# EAGLE design ATmega16 Testboard v2 (EAGLE 4.15)
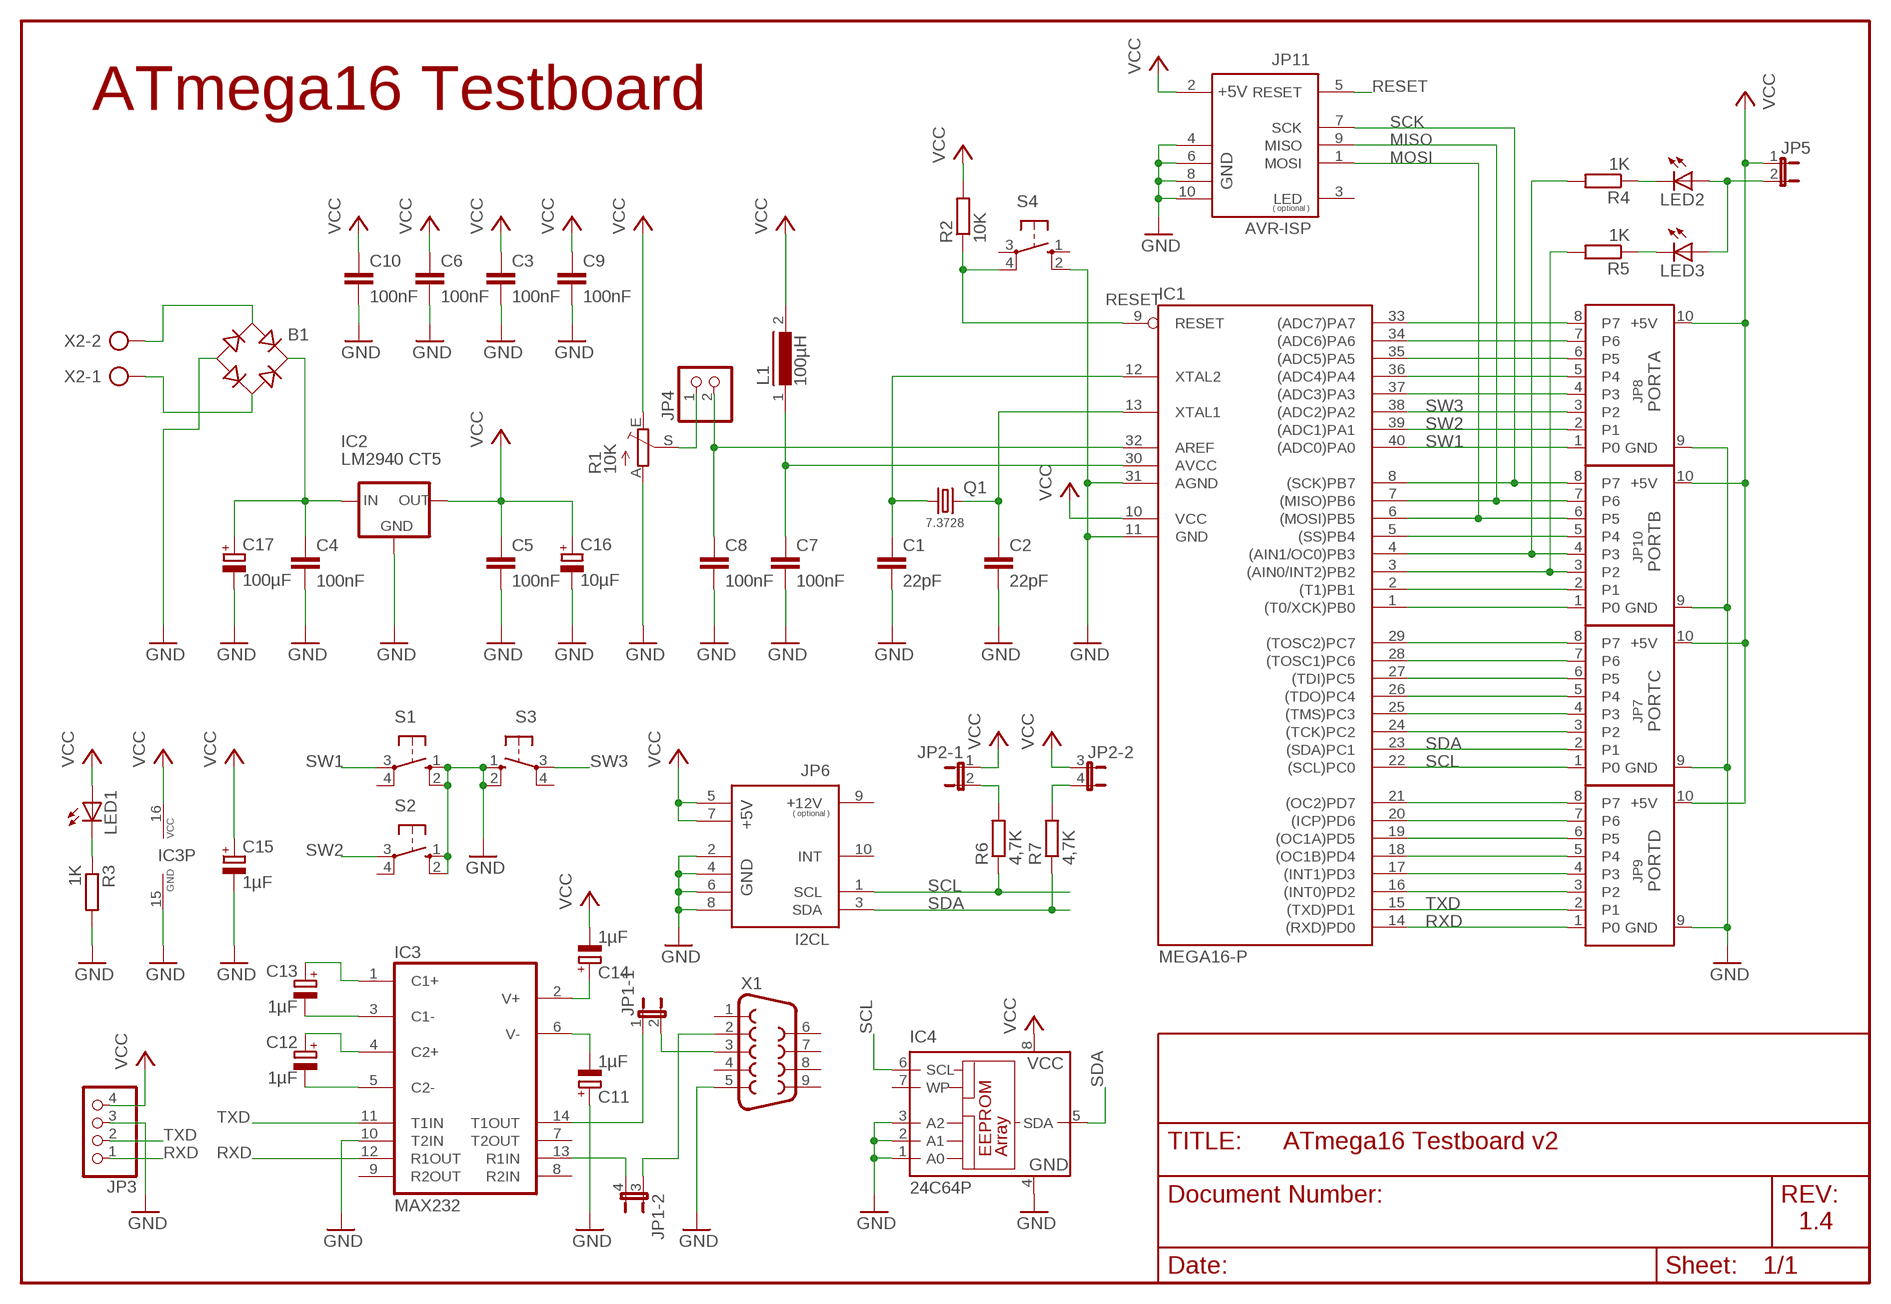
[diagram p0: schematic, sheet 1]

## Parts
B1  RB1A  [RB1A]
C1  22pF  C-EU025-024X044  [C025-024X044]
C2  22pF  C-EU025-024X044  [C025-024X044]
C3  100nF  C-EU025-024X044  [C025-024X044]
C4  100nF  C-EU025-024X044  [C025-024X044]
C5  100nF  C-EU025-024X044  [C025-024X044]
C6  100nF  C-EU025-024X044  [C025-024X044]
C7  100nF  C-EU025-024X044  [C025-024X044]
C8  100nF  C-EU025-024X044  [C025-024X044]
C9  100nF  C-EU025-024X044  [C025-024X044]
C10  100nF  C-EU025-024X044  [C025-024X044]
C11  1µF  CPOL-EUE2.5-5  [E2,5-5]
C12  1µF  CPOL-EUE2.5-5  [E2,5-5]
C13  1µF  CPOL-EUE2.5-5  [E2,5-5]
C14  1µF  CPOL-EUE2.5-5  [E2,5-5]
C15  1µF  CPOL-EUE2.5-5  [E2,5-5]
C16  10µF  CPOL-EUE2-5  [E2-5]
C17  100µF  CPOL-EUE2.5-7  [E2,5-7]
IC1  MEGA16-P  [DIL40]
IC2  LM2940 CT5  78XXL  [78XXL]
IC3  MAX232  [DIL16]
IC4  24C64P  [DIL8]
JP1  JP2QE  [JP2Q]
JP2  JP2QE  [JP2Q]
JP3  PINHD-1X4  [1X04]
JP4  PINHD-1X2V  [1X02/90]
JP5  JP1E  [JP1]
JP6  I2CL  [ML10L]
JP7  PORTC  PORT  [ML10]
JP8  PORTA  PORT  [ML10]
JP9  PORTD  PORT  [ML10]
JP10  PORTB  PORT  [ML10]
JP11  AVR-ISP  [ML10]
L1  100µH  BC12  [BC12]
LED1  LED3MM  [LED3MM]
LED2  LED3MM  [LED3MM]
LED3  LED3MM  [LED3MM]
Q1  7.3728  CRYTALHC49U-V  [HC49U-V]
R1  10K  TRIM_EU-S64Y  [S64Y]
R2  10K  R-EU_0207/7  [0207/7]
R3  1K  R-EU_0207/7  [0207/7]
R4  1K  R-EU_0207/7  [0207/7]
R5  1K  R-EU_0207/7  [0207/7]
R6  4,7K  R-EU_0207/7  [0207/7]
R7  4,7K  R-EU_0207/7  [0207/7]
S1  10-XX  [B3F-10XX]
S2  10-XX  [B3F-10XX]
S3  10-XX  [B3F-10XX]
S4  10-XX  [B3F-10XX]
X1  F09HP  [F09HP]
X2  AK500/2  [AK500/2]

## Nets
AREF: C8.1 IC1.32(AREF) JP4.2
AVCC: C7.1 IC1.30(AVCC) L1.1
GND: B1.- C1.2 C2.2 C3.2 C4.2 C5.2 C6.2 C7.2 C8.2 C9.2 C10.2 C11.+ C15.- C16.- C17.- IC1.11(GND) IC1.31(AGND) IC2.GND IC3.10(T2IN) IC3.15(GND) IC4.1(A0) IC4.2(A1) IC4.3(A2) IC4.4(GND) JP3.3 JP6.2(GND1) JP6.4(GND2) JP6.6(GND3) JP6.8(GND4) JP7.9(GND) JP8.9(GND) JP9.9(GND) JP10.9(GND) JP11.4(GND1) JP11.6(GND2) JP11.8(GND3) JP11.10(GND4) R1.A R3.2 S1.1(S) S1.2(S1) S2.1(S) S2.2(S1) S3.1(S) S3.2(S1) S4.2(S1) X1.5
INT: IC1.24((TCK)PC2) JP7.3(P2)
MISO: IC1.7((MISO)PB6) JP10.7(P6) JP11.9(MISO)
MOSI: IC1.6((MOSI)PB5) JP10.6(P5) JP11.1(MOSI)
N$1: C12.- IC3.5(C2-)
N$2: C12.+ IC3.4(C2+)
N$3: C13.- IC3.3(C1-)
N$5: IC1.3((AIN0/INT2)PB2) JP10.3(P2) R5.2
N$6: C2.1 IC1.13(XTAL1) Q1.2
N$7: C1.1 IC1.12(XTAL2) Q1.1
N$8: C13.+ IC3.1(C1+)
N$9: C14.+ IC3.2(V+)
N$10: C11.- IC3.6(V-)
N$11: B1.+ C4.1 C17.+ IC2.IN
N$12: IC1.29((TOSC2)PC7) JP7.8(P7)
N$13: IC1.28((TOSC1)PC6) JP7.7(P6)
N$14: IC1.27((TDI)PC5) JP7.6(P5)
N$15: IC1.26((TDO)PC4) JP7.5(P4)
N$16: IC1.25((TMS)PC3) JP7.4(P3)
N$17: JP2.4 R7.2
N$18: JP4.1 R1.S
N$19: JP2.2 R6.2
N$21: IC1.21((OC2)PD7) JP9.8(P7)
N$22: IC1.20((ICP)PD6) JP9.7(P6)
N$23: IC1.19((OC1A)PD5) JP9.6(P5)
N$24: IC1.18((OC1B)PD4) JP9.5(P4)
N$25: IC1.17((INT1)PD3) JP9.4(P3)
N$26: IC3.14(T1OUT) JP1.1
N$29: IC3.13(R1IN) JP1.4
N$35: B1.AC2 X2.1
N$36: B1.AC1 X2.2
N$44: IC1.4((AIN1/OC0)PB3) JP10.4(P3) R4.2
N$46: IC1.2((T1)PB1) JP10.2(P1)
N$47: IC1.1((T0/XCK)PB0) JP10.1(P0)
N$48: IC1.16((INT0)PD2) JP9.3(P2)
N$68: LED3.K(C) R5.1
N$69: LED2.K(C) R4.1
N$71: JP5.2 LED2.A LED3.A
N$74: LED1.K(C) R3.1
PA3: IC1.37((ADC3)PA3) JP8.4(P3)
PA4: IC1.36((ADC4)PA4) JP8.5(P4)
PA5: IC1.35((ADC5)PA5) JP8.6(P5)
PA6: IC1.34((ADC6)PA6) JP8.7(P6)
PA7: IC1.33((ADC7)PA7) JP8.8(P7)
RESET: IC1.9(RESET) JP11.5(RESET) R2.1 S4.4(P1)
RXD: IC1.14((RXD)PD0) IC3.12(R1OUT) JP3.1 JP9.1(P0)
SCK: IC1.8((SCK)PB7) JP10.8(P7) JP11.7(SCK)
SCL: IC1.22((SCL)PC0) IC4.6(SCL) JP6.1(SCL) JP7.1(P0) R6.1
SDA: IC1.23((SDA)PC1) IC4.5(SDA) JP6.3(SDA) JP7.2(P1) R7.1
SRXD: JP1.3 X1.2
SS: IC1.5((SS)PB4) JP10.5(P4)
STXD: JP1.2 X1.3
SW1: IC1.40((ADC0)PA0) JP8.1(P0) S1.3(P)
SW2: IC1.39((ADC1)PA1) JP8.2(P1) S2.3(P)
SW3: IC1.38((ADC2)PA2) JP8.3(P2) S3.3(P)
TXD: IC1.15((TXD)PD1) IC3.11(T1IN) JP3.2 JP9.2(P1)
VCC: C3.1 C5.1 C6.1 C9.1 C10.1 C14.- C15.+ C16.+ IC1.10(VCC) IC2.OUT IC3.16(VCC) IC4.8(VCC) JP2.1 JP2.3 JP3.4 JP5.1 JP6.5(+5V1) JP6.7(+5V2) JP7.10(+5V) JP8.10(+5V) JP9.10(+5V) JP10.10(+5V) JP11.2(+5V) L1.2 LED1.A R1.E R2.2
Unconnected: IC3.7(T2OUT) IC3.8(R2IN) IC3.9(R2OUT) IC4.7(WP) JP6.10(INT) S1.4(P1) S2.4(P1) S3.4(P1) S4.1(S) S4.3(P) X1.1 X1.4 X1.6 X1.7 X1.8 X1.9

## Notes on the sheet
- ATmega16 Testboard
- 1.4

## Power pins joined to a net without a drawn wire
+12V: JP6.9(+12V)
LED: JP11.3(LED)

## Library data of the parts
B1 = rectifier:RB1A: RECTIFIER 1 A
C1-C10 = rcl:C-EU: CAPACITOR, European symbol
C11-C17 = rcl:CPOL-EU: POLARIZED CAPACITOR, European symbol
IC1 = avr:MEGA16-P
IC2 = v-reg:78XXL: VOLTAGE REGULATOR
IC3 = maxim:MAX232: RS232 TRANSEIVER
IC4 = microchip:24*: Serial EEPROM I2C
JP1 JP2 = jumper:JP2QE: JUMPER
JP3 = pinhead:PINHD-1X4: PIN HEADER
JP4 = pinhead:PINHD-1X2: PIN HEADER
JP5 = jumper:JP1E: JUMPER
JP6 = roboternetz-definitionen:I2C
JP7-JP10 = andereBauteile:PORT
JP11 = roboternetz-definitionen:AVR-ISP: AVR ISP ( In System Programm ) Stecker
L1 = inductors:BC12: INDUCTOR
LED1-LED3 = led:LED: LED OSRAM: - CHIPLED LG R971, LG N971, LY N971, LG Q971, LY Q971, LO R971, LY R971 LH N974, LH R974 LS Q976, LO Q976, LY Q976 LO Q996 - Hyper CHIPLED LW Q18S LB Q993, LB Q99A, LB R99A - SideLED LS A670, LO A670, LY A670, LG A670, LP A670 LB A673, LV A673, LT A673, LW A673 LH A674 LY A675 LS A676, LA A676, LO A676, LY A676, LW A676 LS A679, LY A679, LG A679 - Hyper Micro SIDELED® LS Y876, LA Y876, LO Y876, LY Y876 LT Y87S - SmartLED LW L88C, LW L88S LB L89C, LB L89S, LG L890 LS L89K, LO L89K, LY L89K LS L896, LA L896, LO L896, LY L896 - TOPLED LS T670, LO T670, LY T670, LG T670, LP T670 LSG T670, LSP T670, LSY T670, LOP T670, LYG T670 LG T671, LOG T671, LSG T671 LB T673, LV T673, LT T673, LW T673 LH T674 LS T676, LA T676, LO T676, LY T676, LB T676, LH T676, LSB T676, LW T676 LB T67C, LV T67C, LT T67C, LS T67K, LO T67K, LY T67K, LW E67C LS E67B, LA E67B, LO E67B, LY E67B, LB E67C, LV E67C, LT E67C LW T67C LS T679, LY T679, LG T679 LS T770, LO T770, LY T770, LG T770, LP T770 LB T773, LV T773, LT T773, LW T773 LH T774 LS E675, LA E675, LY E675, LS T675 LS T776, LA T776, LO T776, LY T776, LB T776 LHGB T686 LT T68C, LB T68C - Hyper Mini TOPLED® LB M676 - Mini TOPLED Santana® LG M470 LS M47K, LO M47K, LY M47K Source: http://www.osram.convergy.de/
Q1 = crystal:CRYTAL: CRYSTAL
R1 = pot:TRIM_EU-: POTENTIOMETER
R2-R7 = rcl:R-EU_: RESISTOR, European symbol
S1-S4 = switch-omron:10-XX: OMRON SWITCH
X1 = con-subd:F09: SUB-D
X2 = con-ptr500:AK500/2: CONNECTOR

## Board
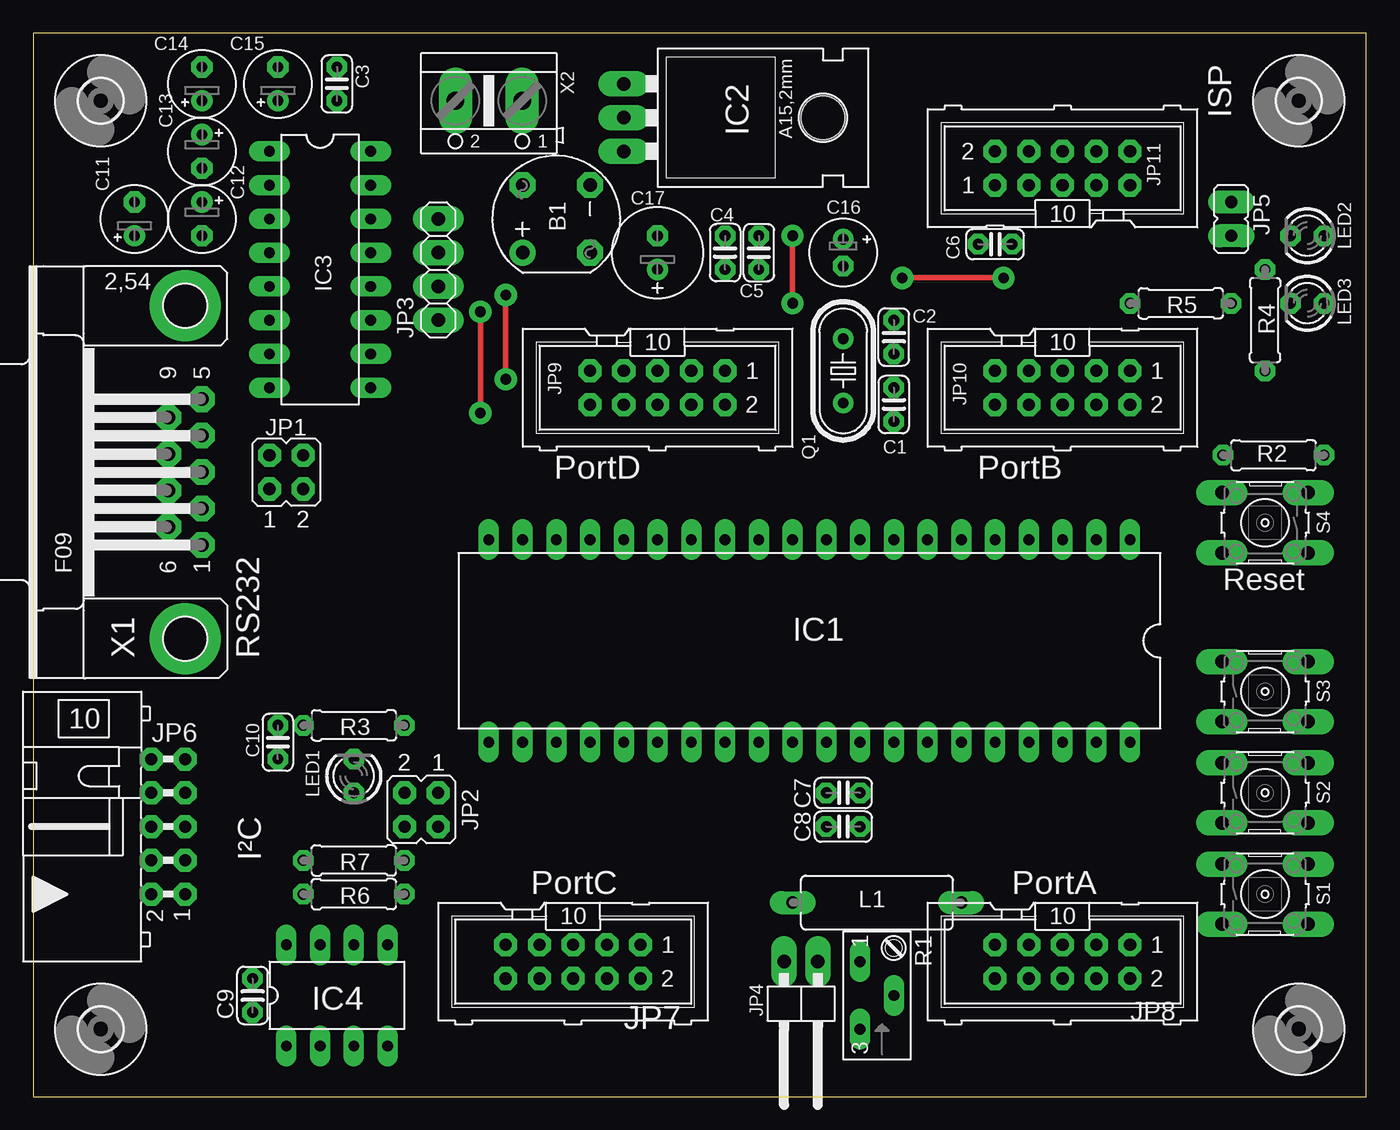
[diagram p1: board, top side]
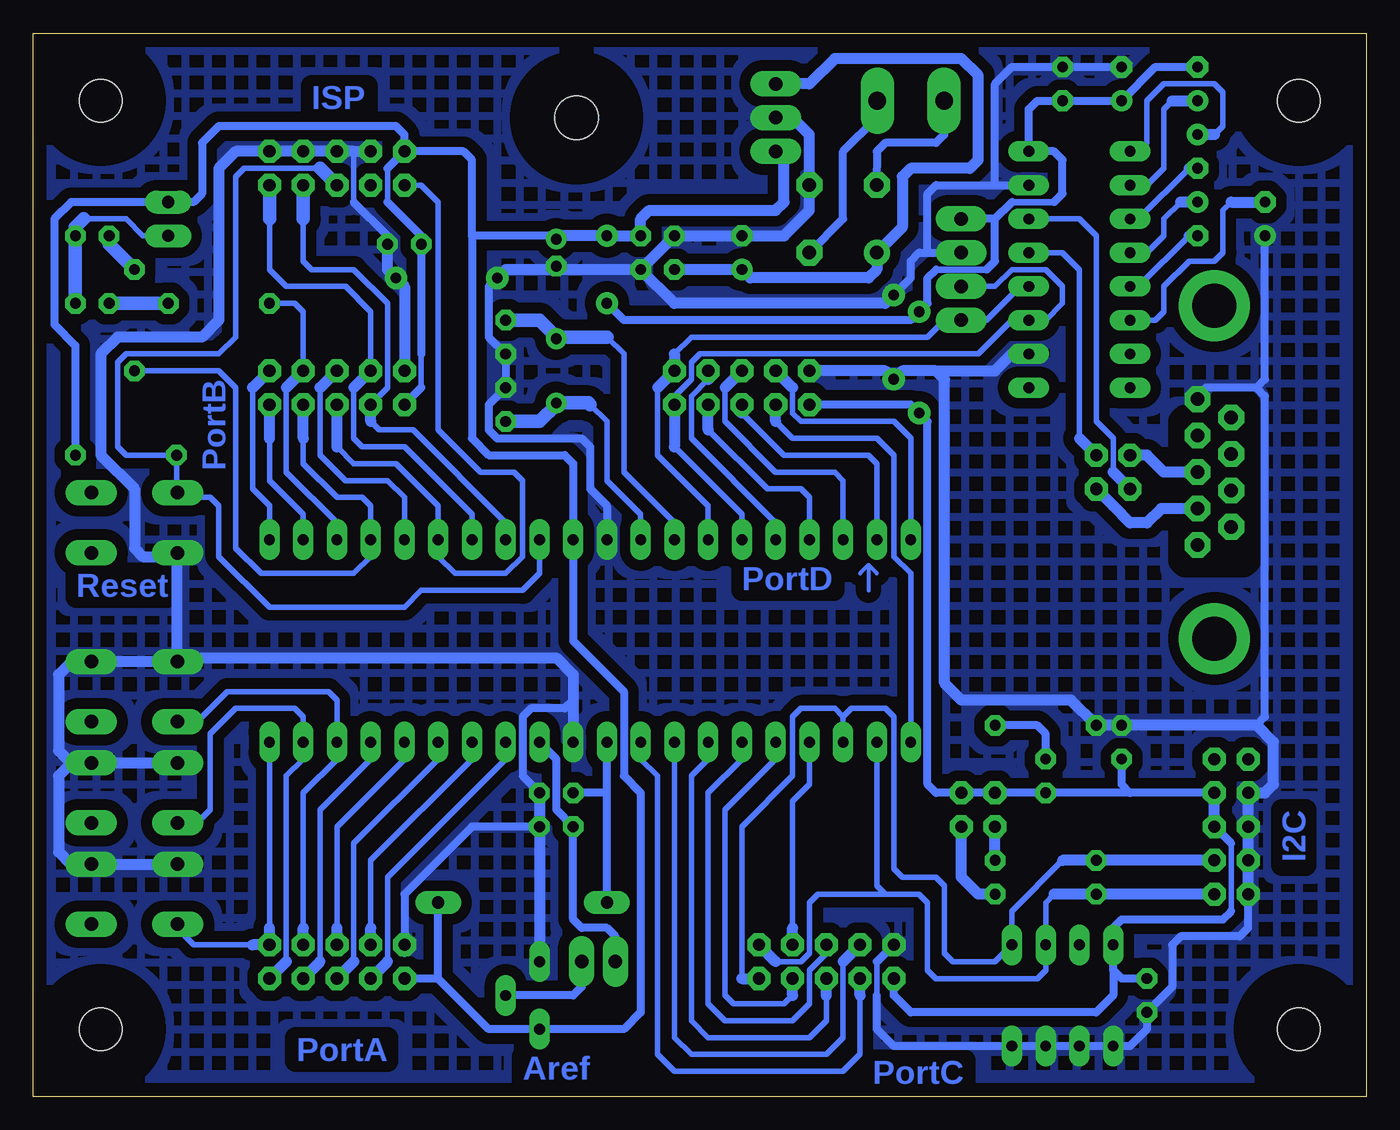
[diagram p2: board, bottom side, seen from below]

Size 100.33 x 80.01 mm. Coordinates in mm from the lower left corner, seen from the top.
Outline: 0,0 100.33,0 100.33,80.01 0,80.01 0,0
Copper layers (1*16): Top 0.035mm / dielectric 1.5mm / Bottom 0.035mm
Design rules "default": minimum track width 10mil, minimum drill 1mm, track to track 8mil, track to pad 8mil, pad to pad 8mil, via to via 8mil, smd to smd 8mil, copper to edge 40mil, drill to drill 8mil, minimum pad ring 10mil, minimum via ring 8mil, stop-mask expansion 5mil, vias tented up to drill 0mil, thermal gap 10mil
bRestrict: 18 lines

### Footprints (pad centres in the part's own frame; a part is rotated, then mirrored left to right if it is on the bottom)
RB1A = drill 1.016 round: + -2.54,2.54 | drill 1.016 octagon: - 2.54,-2.54; AC1 2.54,2.54; AC2 -2.54,-2.54
C025-024X044 = drill 0.813 octagon: 1 -1.27,0; 2 1.27,0
E2,5-5 = drill 0.813 pad 1.6 round: + -1.27,0 | drill 0.813 pad 1.6 octagon: - 1.27,0
E2-5 = drill 0.813 pad 1.27 round: + -1.016,0 | drill 0.813 pad 1.27 octagon: - 1.016,0
E2,5-7 = drill 0.813 pad 1.6 round: + -1.27,0 | drill 0.813 pad 1.6 octagon: - 1.27,0
DIL40 = drill 0.813 long: 1 -24.13,-7.62; 2 -21.59,-7.62; 3 -19.05,-7.62; 4 -16.51,-7.62; 5 -13.97,-7.62; 6 -11.43,-7.62; 7 -8.89,-7.62; 8 -6.35,-7.62; 9 -3.81,-7.62; 10 -1.27,-7.62; 11 1.27,-7.62; 12 3.81,-7.62; 13 6.35,-7.62; 14 8.89,-7.62; 15 11.43,-7.62; 16 13.97,-7.62; 17 16.51,-7.62; 18 19.05,-7.62; 19 21.59,-7.62; 20 24.13,-7.62; 21 24.13,7.62; 22 21.59,7.62; 23 19.05,7.62; 24 16.51,7.62; 25 13.97,7.62; 26 11.43,7.62; 27 8.89,7.62; 28 6.35,7.62; 29 3.81,7.62; 30 1.27,7.62; 31 -1.27,7.62; 32 -3.81,7.62; 33 -6.35,7.62; 34 -8.89,7.62; 35 -11.43,7.62; 36 -13.97,7.62; 37 -16.51,7.62; 38 -19.05,7.62; 39 -21.59,7.62; 40 -24.13,7.62
78XXL = drill 1.016 long: GND 0,-3.81; IN -2.54,-3.81; OUT 2.54,-3.81 | hole 3.302: 0,11.176
DIL16 = drill 0.813 long: 1 -8.89,-3.81; 2 -6.35,-3.81; 3 -3.81,-3.81; 4 -1.27,-3.81; 5 1.27,-3.81; 6 3.81,-3.81; 7 6.35,-3.81; 8 8.89,-3.81; 9 8.89,3.81; 10 6.35,3.81; 11 3.81,3.81; 12 1.27,3.81; 13 -1.27,3.81; 14 -3.81,3.81; 15 -6.35,3.81; 16 -8.89,3.81
DIL8 = drill 0.813 long: 1 -3.81,-3.81; 2 -1.27,-3.81; 3 1.27,-3.81; 4 3.81,-3.81; 5 3.81,3.81; 6 1.27,3.81; 7 -1.27,3.81; 8 -3.81,3.81
JP2Q = drill 0.914 octagon: 1 -1.27,-1.27; 2 -1.27,1.27; 3 1.27,-1.27; 4 1.27,1.27
1X04 = drill 1.016 long: 1 -3.81,0; 2 -1.27,0; 3 1.27,0; 4 3.81,0
1X02/90 = drill 1.016 long: 1 -1.27,0; 2 1.27,0
JP1 = drill 0.914 long: 1 0,-1.27; 2 0,1.27
ML10L = drill 0.914 octagon: 1 -5.08,-1.27; 2 -5.08,1.27; 3 -2.54,-1.27; 4 -2.54,1.27; 5 0,-1.27; 6 0,1.27; 7 2.54,-1.27; 8 2.54,1.27; 9 5.08,-1.27; 10 5.08,1.27
ML10 = drill 0.914 octagon: 1 -5.08,-1.27; 2 -5.08,1.27; 3 -2.54,-1.27; 4 -2.54,1.27; 5 0,-1.27; 6 0,1.27; 7 2.54,-1.27; 8 2.54,1.27; 9 5.08,-1.27; 10 5.08,1.27
BC12 = drill 0.914 long: 1 -6.35,0; 2 6.35,0
LED3MM = drill 0.813 octagon: A -1.27,0; K 1.27,0
HC49U-V = drill 0.813 round: 1 -2.413,0; 2 2.413,0
S64Y = drill 0.813 long: A 2.54,1.27; E -2.54,1.27; S 0,-1.27
0207/7 = drill 0.813 octagon: 1 -3.81,0; 2 3.81,0
B3F-10XX = drill 1.016 long: 1 -3.251,2.261; 2 3.251,2.261; 3 -3.251,-2.261; 4 3.251,-2.261
3,2 = hole 3.2: 0,0
F09HP = drill 1.016 octagon: 1 -5.486,-1.27; 2 -2.743,-1.27; 3 0,-1.27; 4 2.743,-1.27; 5 5.486,-1.27; 6 -4.115,1.27; 7 -1.372,1.27; 8 1.372,1.27; 9 4.115,1.27 | drill 3.302 pad 5.08 round: G1 -12.522,0; G2 12.522,0
AK500/2 = drill 1.321 long: 1 -2.515,0; 2 2.515,0

### Placement (x,y rotation side)
B1  39.37,66.04 90 top
C1  64.77,52.07 90 top
C2  64.77,57.15 270 top
C3  22.86,76.2 90 top
C4  52.07,63.5 90 top
C5  54.61,63.5 270 top
C6  72.39,64.14 0 top
C7  60.96,22.86 0 top
C8  60.96,20.32 0 top
C9  16.51,7.62 270 top
C10  18.41,26.67 90 top
C11  7.62,66.04 90 top
C12  12.7,66.04 270 top
C13  12.7,71.12 270 top
C14  12.7,76.2 90 top
C15  18.41,76.2 90 top
C16  60.96,63.5 270 top
C17  46.99,63.5 90 top
IC1  58.42,34.29 180 top
IC2  48.26,73.66 270 top
IC3  21.59,62.23 270 top
IC4  22.86,7.62 0 top
JP1  19.05,46.99 0 top
JP2  29.21,21.59 180 top
JP3  30.48,62.23 90 top
JP4  57.78,10.16 180 top
JP5  90.17,66.04 180 top
JP6  10.16,20.32 90 top
JP7  40.64,10.16 180 top
JP8  77.47,10.16 180 top
JP9  46.99,53.34 180 top
JP10  77.47,53.34 180 top
JP11  77.47,69.85 0 top
L1  63.5,14.61 0 top
LED1  24.13,24.13 90 top
LED2  95.89,64.77 180 top
LED3  95.89,59.69 180 top
Q1  60.96,54.61 90 top
R1  63.5,7.62 90 top
R2  93.34,48.26 0 top
R3  24.13,27.94 180 top
R4  92.71,58.42 270 top
R5  86.36,59.69 180 top
R6  24.13,15.24 0 top
R7  24.13,17.78 0 top
S1  92.71,15.24 0 top
S2  92.71,22.86 0 top
S3  92.71,30.48 0 top
S4  92.71,43.18 180 top
U$1  [3,2]  5.08,5.08 0 top
U$2  [3,2]  95.25,5.08 0 top
U$3  [3,2]  95.25,74.93 0 top
U$4  [3,2]  5.08,74.93 0 top
X1  11.43,46.99 90 top
X2  34.29,74.93 180 top

### Tracks (layer width: path | path; a pad name or v marks a point on that pad's centre or on a via)
AREF
  Bottom 0.61: IC1.32 60.96,25.4 60.96,21.59 C8.1 59.69,13.34 59.05,12.7 57.15,12.7 56.52,12.06 JP4.2
AVCC
  Bottom 0.61: 57.15,22.86 IC1.30 | 57.15,22.86 C7.1 | L1.1 57.15,22.86
GND  (via drill 0.8 pad 1.68)
  Top 0.406: v35.56,53.98 v35.56,60.33 | v65.41,61.59 v73.03,61.59
  Bottom 0.406: 89.53,40.64 89.46,40.72 S4.2 | 96.16,25.12 S2.2 97.51,25.12 | S3.2 95.96,32.94 95.89,33.02 95.61,32.74 | S1.1 89.46,17.7 89.53,17.78 89.81,17.5 | S2.1 89.46,25.32 89.53,25.4 89.81,25.12 | 76.2,67.31 76.2,71.12 | 36.83,7.62 36.83,10.16
  Bottom 0.61: IC1.11 57.15,44.45 58.42,45.72 58.42,48.9 59.05,49.53 65.41,49.53 66.04,50.16 66.04,52.07 C1.2 C2.2 66.04,57.15 66.04,60.96 v65.41,61.59 | C8.2 67.31,20.32 72.39,15.24 JP8.9 72.39,10.79 | 60.96,62.23 C16.- | v35.56,60.33 34.29,61.59 34.29,62.87 33.66,63.5 33.02,63.5 | 27.94,68.58 27.94,76.2 26.67,77.47 C3.2 C15.- | C7.2 63.5,24.13 63.5,28.57 62.87,29.21 60.33,29.21 59.69,29.84 | 33.02,63.5 JP3.3 | 27.94,68.58 IC3.15 | 27.94,68.58 32.38,68.58 33.02,67.94 33.02,63.5 | X1.5 12.7,52.7 12.06,53.34 8.26,53.34 | 8.26,53.34 7.62,53.98 C11.+ | 89.53,33.02 89.46,32.94 S3.1 | 36.83,7.62 36.83,5.08 35.56,3.81 IC4.4 IC4.3 IC4.2 IC4.1 17.78,3.81 16.51,5.08 C9.2 14.61,8.26 14.61,11.43 13.97,12.06 9.53,12.06 8.89,12.7 JP6.2 | 36.83,10.16 JP7.9 | 8.26,53.34 7.62,52.7 7.62,28.57 8.26,27.94 | 76.2,67.31 73.66,64.77 C6.2
  Bottom 0.813: JP6.2 JP6.4 JP6.6 JP6.8 7.62,22.86 6.99,23.5 6.99,26.67 8.26,27.94 C10.2 | JP11.4 76.2,71.12 JP11.6 JP11.8 JP11.10 85.09,71.12 86.36,69.85 86.36,58.42 87.63,57.15 93.98,57.15 95.25,55.88 95.25,48.26 92.71,45.72 92.71,41.27 92.08,40.64 89.53,40.64 89.53,33.02 60.96,33.02 59.69,31.75 59.69,29.84 IC1.31 | IC2.GND 43.18,73.66 41.91,72.39 B1.- 41.91,66.67 43.81,64.77 C17.- C4.2 C5.2 | C5.2 60.96,62.23 64.77,62.23 v65.41,61.59 | C5.2 52.07,59.69 36.2,59.69 v35.56,60.33 | JP9.9 36.2,54.61 v35.56,53.98 34.92,54.61 32.38,54.61 | C7.2 C8.2 R1.A | IC3.10 26.67,55.88 27.94,54.61 32.38,54.61 | S3.1 95.61,32.74 | S3.2 97.43,32.74 98.42,31.75 98.42,26.04 97.51,25.12 | 89.81,17.5 S1.2 97.51,17.5 98.42,18.41 98.42,24.13 97.43,25.12 S2.2 89.81,25.12 | JP10.9 72.39,60.96 v73.03,61.59 73.66,62.23 C6.2 | 32.38,54.61 31.75,53.98 31.75,31.11 30.48,29.84 22.23,29.84 R3.2 | C10.2 R3.2 | C10.2 R3.2
  pour Bottom (isolate 0.813, rank 6, no thermals, hatched): 0,80.01 100.33,80.01 100.33,0 0,0
INT
  Bottom 0.406: 43.18,12.7 43.18,22.23 41.91,23.5 IC1.24
  Bottom 0.813: JP7.3 43.18,12.7
MISO
  Bottom 0.406: IC1.7 67.31,43.81 72.39,48.9 75.56,48.9 76.2,49.53 76.2,53.34 | 82.55,66.04 82.55,62.23 81.28,60.96 76.83,60.96 74.93,59.05 JP10.7
  Bottom 0.813: 76.2,53.34 JP10.7
  Bottom 1.016: 82.55,66.04 JP11.9
MOSI
  Bottom 0.406: 77.47,48.9 76.2,47.62 73.03,47.62 69.85,44.45 IC1.6 69.85,40.64 68.58,39.37 64.77,39.37 63.5,40.64 63.5,46.35 64.14,46.99 66.67,46.99 69.85,50.16 69.85,67.31 71.12,68.58 JP11.1
  Bottom 0.813: 77.47,48.9 JP10.6
N$1
  Bottom 0.406: 13.34,64.77 17.14,60.96 IC3.5
  Bottom 0.813: C12.- 13.34,64.77
N$2
  Bottom 0.406: 13.97,67.31 15.24,66.04 15.24,64.77 16.51,63.5 IC3.4
  Bottom 0.813: C12.+ 13.97,67.31
N$3
  Bottom 0.406: 13.34,69.85 17.14,66.04 IC3.3
  Bottom 0.813: C13.- 13.34,69.85
N$4
  Bottom 0.305: 37.47,40.01 37.47,38.1 | 37.47,40.01 36.83,39.37 | 37.47,40.01 38.1,39.37
N$5
  Bottom 0.406: IC1.3 77.47,43.18 81.28,46.99 81.28,53.34 | R5.2 80.64,59.69 80.01,59.05 JP10.3
  Bottom 0.813: 81.28,53.34 JP10.3
N$6
  Bottom 0.406: IC1.13 52.07,43.18 55.88,46.99 55.88,55.88 57.15,57.15
  Bottom 1.016: C2.1 62.23,58.42 60.96,57.15 | 60.96,57.15 Q1.2 | 57.15,57.15 60.96,57.15
N$7
  Bottom 0.406: IC1.12 54.61,43.81 57.15,46.35 57.15,50.8 58.42,52.07
  Bottom 1.016: C1.1 62.23,50.8 60.96,52.07 Q1.1 58.55,52.2 58.42,52.07
N$8
  Bottom 0.406: 11.43,72.39 10.79,73.03 10.79,75.56 11.43,76.2 15.24,76.2 16.51,74.93 16.51,71.75 17.14,71.12 IC3.1
  Bottom 0.813: 11.43,72.39 C13.+
N$9
  Bottom 0.406: IC3.2 16.51,68.58 15.24,69.85 15.24,74.3 14.61,74.93
  Bottom 0.813: 14.61,74.93 C14.+
N$10
  Bottom 0.406: 10.16,67.31 10.79,66.67 10.79,63.5 11.43,62.87 13.34,62.87 15.24,60.96 15.24,59.05 15.88,58.42 IC3.6
  Bottom 0.813: 10.16,67.31 C11.-
N$11
  Bottom 0.813: C4.1 C17.+ 46.35,61.59 37.47,61.59 36.83,62.23 B1.+ 34.92,65.41 34.92,69.22 34.29,69.85 29.84,69.85 29.21,70.48 29.21,76.83 30.48,78.11 40.01,78.11 41.91,76.2 IC2.IN
N$12
  Bottom 0.406: 38.1,7.62 38.1,3.17 39.37,1.91 52.07,1.91 53.34,3.17 53.34,24.13 54.61,25.4 IC1.29
  Bottom 0.813: 38.1,7.62 JP7.8
N$13
  Bottom 0.406: 39.37,10.16 39.37,4.45 40.64,3.17 50.8,3.17 52.07,4.45 IC1.28
  Bottom 0.813: 39.37,10.16 JP7.7
N$14
  Bottom 0.406: 40.64,7.62 40.64,5.71 41.91,4.45 49.53,4.45 50.8,5.71 50.8,24.13 49.53,25.4 IC1.27
  Bottom 0.813: 40.64,7.62 JP7.6
N$15
  Bottom 0.406: JP7.5 40.64,10.79 41.91,9.53 41.91,6.99 43.18,5.71 48.26,5.71 49.53,6.99 49.53,22.86 46.99,25.4 IC1.26
N$16
  Bottom 0.406: 43.18,7.62 43.81,6.99 47.62,6.99 48.26,7.62 48.26,21.59 44.45,25.4 IC1.25
  Bottom 0.813: 43.18,7.62 JP7.4
N$17
  Bottom 0.813: R7.2 JP2.4
N$18
  Bottom 0.61: R1.S 59.69,7.62 59.05,8.26 JP4.1
N$19
  Bottom 0.813: R6.2 29.21,15.24 30.48,16.51 JP2.2
N$21
  Bottom 0.406: 44.45,50.8 43.18,49.53 36.83,49.53 35.56,48.26 35.56,40.64 34.29,39.37 IC1.21
  Bottom 0.813: 44.45,50.8 JP9.8
N$22
  Bottom 0.406: 43.18,53.34 43.18,51.44 42.55,50.8 35.56,50.8 34.29,49.53 IC1.20
  Bottom 0.813: 43.18,53.34 JP9.7
N$23
  Bottom 0.406: IC1.19 36.83,47.62 37.47,48.26 43.81,48.26 46.99,51.44
  Bottom 0.813: 46.99,51.44 JP9.6
N$24
  Bottom 0.406: IC1.18 39.37,46.35 40.01,46.99 44.45,46.99 48.26,50.8 48.26,53.34
  Bottom 0.813: 48.26,53.34 JP9.5
N$25
  Bottom 0.406: IC1.17 41.91,45.09 42.55,45.72 45.09,45.72 49.53,50.16
  Bottom 0.813: 49.53,50.16 JP9.4
N$26
  Bottom 0.406: IC3.14 21.59,66.04 20.32,64.77 20.32,50.8 19.05,49.53 19.05,46.99
  Bottom 0.813: JP1.1 19.05,46.99
N$29
  Bottom 0.406: IC3.13 22.86,63.5 21.59,62.23 21.59,49.53
  Bottom 0.813: JP1.4 21.59,49.53
N$35
  Bottom 0.61: B1.AC2 39.37,66.04 39.37,71.12 36.83,73.66 36.8,74.27 36.8,74.91 36.83,74.93 X2.1
N$36
  Bottom 0.61: B1.AC1 36.85,68.61 36.83,71.12 36.2,71.75 32.38,71.75 31.77,72.36 31.77,74.91 31.75,74.93 X2.2
N$44
  Bottom 0.406: 80.01,49.53 80.01,47.62 77.47,45.09 75.56,45.09 74.93,44.45 IC1.4 74.93,40.64 76.2,39.37 83.19,39.37 85.09,41.27 85.09,53.34 86.36,54.61 R4.2
  Bottom 0.813: 80.01,49.53 JP10.4
N$46
  Bottom 0.406: IC1.2 80.01,43.81 82.55,46.35 82.55,49.53
  Bottom 0.813: 82.55,49.53 JP10.2
N$47
  Bottom 0.406: IC1.1 82.55,44.45 83.82,45.72 83.82,53.34
  Bottom 0.813: 83.82,53.34 JP10.1
N$48
  Bottom 0.406: 49.53,53.98 50.8,52.7 50.8,49.53 44.45,43.18 IC1.16
  Bottom 0.813: 49.53,53.98 JP9.3
N$68
  Bottom 1.016: R5.1 LED3.K
N$69
  Bottom 1.016: LED2.K 94.61,64.14 R4.1
N$71
  Bottom 0.406: 96.52,66.04 93.34,66.04 92.08,64.77 JP5.2
  Bottom 1.016: LED3.A LED2.A 97.16,65.41 96.52,66.04
N$74
  Bottom 0.61: R3.1 24.77,27.94 24.13,27.3 LED1.K
PA3
  Bottom 0.406: 78.74,10.16 78.74,21.59 74.93,25.4 IC1.37
  Bottom 0.813: JP8.4 78.74,10.16
PA4
  Bottom 0.406: IC1.36 72.39,25.4 77.47,20.32 77.47,12.7
  Bottom 0.813: JP8.5 77.47,12.7
PA5
  Bottom 0.406: IC1.35 69.85,25.4 76.2,19.05 76.2,10.16
  Bottom 0.813: JP8.6 76.2,10.16
PA6
  Bottom 0.406: 74.93,12.7 74.93,17.78 67.31,25.4 IC1.34
  Bottom 0.813: JP8.7 74.93,12.7
PA7
  Bottom 0.406: IC1.33 64.77,25.4 73.66,16.51 73.66,10.16
  Bottom 0.813: JP8.8 73.66,10.16
RESET
  Bottom 0.406: 78.74,69.85 84.45,69.85 85.09,69.22 85.09,57.15 86.36,55.88 93.34,55.88 93.98,55.24 93.98,48.9 93.34,48.26 R2.1 89.53,45.72 89.46,45.16 | IC1.9 62.23,39.37 63.5,38.1 71.12,38.1 72.39,36.83 82.55,36.83 86.36,40.64 86.36,44.45 87,45.09 89.53,45.09 89.46,45.16 | 89.46,45.16 S4.4
  Bottom 1.016: 78.74,69.85 JP11.5
RXD
  Bottom 0.406: 53.34,53.34 53.34,48.26 49.53,44.45 IC1.14 | 52.07,55.88 50.8,57.15 33.02,57.15 31.75,58.42 JP3.1 28.57,58.42 26.04,60.96 IC3.12
  Bottom 0.813: 53.34,53.34 JP9.1 52.07,55.88
SCK
  Bottom 0.406: IC1.8 64.77,43.18 71.75,50.16 74.3,50.16 74.93,50.8 | JP10.8 73.66,53.34 73.66,59.69 76.2,62.23 79.38,62.23 80.01,62.87 80.01,66.04
  Bottom 0.813: 74.93,50.8 JP10.8
  Bottom 1.016: 80.01,66.04 JP11.7
SCL
  Bottom 0.406: 44.45,10.16 42.55,10.16 41.91,10.79 41.91,14.61 41.27,15.24 36.2,15.24 | IC1.22 36.83,15.88 36.2,15.24 | 36.2,15.24 33.66,15.24 33.02,14.61 33.02,9.53 32.38,8.89 24.77,8.89 24.13,9.53 IC4.6 24.13,14.61 23.5,15.24
  Bottom 0.813: 44.45,10.16 JP7.1 | 23.5,15.24 R6.1 JP6.1
SDA
  Bottom 0.406: 46.99,10.16 46.99,20.32 43.18,24.13 43.18,28.57 42.55,29.21 40.01,29.21 39.37,28.57 | 46.99,10.16 46.99,9.53 | 39.37,28.57 IC1.23 | 39.37,28.57 38.73,29.21 36.2,29.21 35.56,28.57 35.56,17.14 34.92,16.51 32.38,16.51 31.75,15.88 31.75,10.79 31.11,10.16 27.94,10.16 IC4.5 26.67,13.97 22.86,17.78 | 46.99,10.16 46.99,8.89
  Bottom 0.813: 46.99,8.89 JP7.2 | JP6.3 R7.1 22.86,17.78
SRXD
  Bottom 0.813: 19.05,44.45 18.41,43.81 | 19.05,44.45 JP1.3 | X1.2 15.44,44.25 16.51,43.18 17.78,43.18 19.05,44.45
SS
  Bottom 0.406: IC1.5 72.39,45.09 73.66,46.35 76.83,46.35 78.74,48.26 78.74,53.34
  Bottom 0.813: 78.74,53.34 JP10.5
STXD
  Bottom 0.813: JP1.2 16.51,48.26 15.24,46.99 X1.3
SW1
  Bottom 0.406: 82.55,12.7 IC1.40 | S1.3 89.46,12.78 89.53,12.7 88.27,11.43 83.82,11.43
  Bottom 0.813: 82.55,12.7 JP8.1 83.82,11.43
SW2
  Bottom 0.406: S2.3 87.99,20.6 87,21.59 87,27.3 85.09,29.21 80.64,29.21 80.01,28.57 IC1.39 80.01,25.4 81.28,24.13 81.28,10.16
  Bottom 0.813: JP8.2 81.28,10.16
SW3
  Bottom 0.406: 80.01,12.7 80.01,22.86 77.47,25.4 IC1.38 77.47,29.84 78.11,30.48 85.72,30.48 87.99,28.22 S3.3
  Bottom 0.813: JP8.3 80.01,12.7
TXD
  Bottom 0.406: 52.07,48.9 46.99,43.81 IC1.15 | JP9.2 52.07,52.7 50.8,53.98 50.8,55.24 50.16,55.88 29.21,55.88 26.67,58.42 IC3.11 24.13,58.42 22.86,59.69 22.86,60.96 24.13,62.23 26.67,62.23 27.94,60.96 JP3.2
  Bottom 0.813: JP9.2 52.07,48.9
VCC  (via drill 0.8 pad 1.68)
  Top 0.406: v57.15,59.69 v57.15,64.77 | v33.66,51.44 v33.66,59.05
  Bottom 0.406: 73.66,69.85 73.66,67.31 | 71.12,55.88 71.12,53.34 | 10.16,13.97 10.16,19.05
  Bottom 0.5: 26.67,67.31 23.5,67.31 | 32.38,62.23 28.57,62.23
  Bottom 0.61: 67.31,64.77 67.31,49.53 66.04,48.26 60.33,48.26 59.69,47.62 IC1.10 59.69,34.29 55.88,30.48 55.88,24.13 54.61,22.86 54.61,6.35 55.88,5.08 R1.E 66.04,5.08 69.85,8.89 | 67.31,64.77 67.31,70.48 67.94,71.12 JP11.2 | C16.+ 60.96,64.77 67.31,64.77 | JP9.10 34.29,52.07 v33.66,51.44 33.02,50.8 33.02,23.5 32.38,22.86 JP2.1 JP2.3 LED1.A 17.78,22.86 | 23.5,67.31 22.86,67.94 22.86,70.48 23.5,71.12 IC3.16 25.4,74.3 24.77,74.93 | 32.38,62.23 33.02,61.59 33.02,59.69 v33.66,59.05 34.29,58.42 55.88,58.42 v57.15,59.69 | 28.57,62.23 27.94,62.87 27.94,66.04 | 27.94,66.04 26.67,67.31 | 27.94,66.04 JP3.4 | C14.- 15.88,77.47 C15.+ 24.77,74.93 | JP11.2 72.39,72.39 73.03,73.03 86.36,73.03 87.63,71.75 87.63,67.94 88.27,67.31 JP5.1 97.47,67.31 98.74,66.04 98.74,58.1 97.16,56.52 R2.2 | 69.85,8.89 JP8.10 | 69.85,8.89 L1.2 | JP7.10 35.56,7.62 34.29,6.35 20.32,6.35 19.05,7.62 19.05,9.53 | 19.05,9.53 IC4.8 19.05,12.7 18.41,13.34 10.79,13.34 10.16,13.97 | 10.16,19.05 JP6.5 | JP6.7 17.78,22.86 | 24.77,74.93 C3.1 | 71.12,53.34 JP10.10 | 71.12,55.88 C6.1 71.12,64.77 73.66,67.31 | JP11.2 73.66,69.85 | C10.1 18.41,23.5 17.78,22.86 | C9.1 18.41,8.89 19.05,9.53
  Bottom 0.813: JP6.5 JP6.7 | 60.96,64.77 v57.15,64.77 C5.1 54.61,66.04 53.98,66.67 44.45,66.67 43.81,67.31 43.81,70.48 IC2.OUT

### Text on the board
Bottom: ISP | PortB | Reset | PortD | I2C | PortA | PortC | Aref
tPlace: ISP | PortD | PortB | RS232 | Reset | I²C | PortC | PortA